# EAGLE design 180V PSU (EAGLE 6.1)
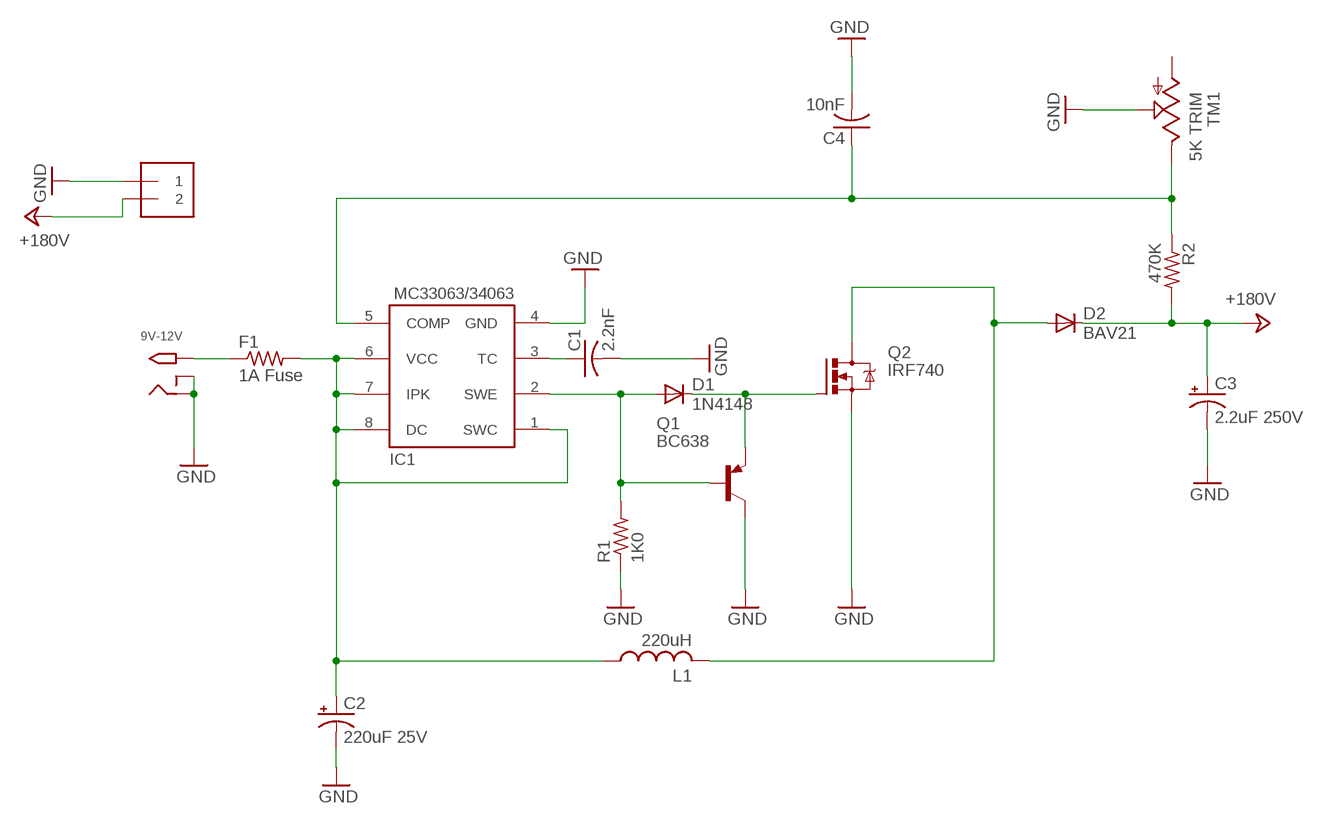
[diagram p0: schematic, sheet 1]

## Parts
9V-12V  2.1MMJACKTHM  [PJ-102A]
C1  2.2nF  C-US025-030X050  [C025-030X050]
C2  220uF 25V  CPOL-USE2.5-6  [E2,5-6]
C3  2.2uF 250V  CPOL-USE2.5-6  [E2,5-6]
C4  10nF  C-US025-030X050  [C025-030X050]
D1  1N4148  1N4148DO35-10  [DO35-10]
D2  BAV21  [DO35-10]
F1  1A Fuse  R-US_0204/5  [0204/5]
IC1  MC33063/MC34063P  [DIL08]
J1  1X2-3.5MM  [1X2-3.5MM]
L1  220uH  L-US6000-XXX-RC  [6000-XXXX-RC]
Q1  BC638  [TO92-BCE]
Q2  IRF740  [TO220BV]
R1  1K0  R-US_0207/10  [0207/10]
R2  470K  R-US_0207/10  [0207/10]
TM1  5K TRIM  TRIM  [6MM]

## Nets
+24V: C3.+ D2.C J1.2 R2.2 ; supply symbol labelled +180V
GND: 9V-12V.RING 9V-12V.RING_SW C1.2 C2.- C3.- C4.2 IC1.4(GND) J1.1 Q1.C Q2.S R1.1 TM1.S
N$1: 9V-12V.TIP F1.1
N$2: D2.A L1.2 Q2.D
N$3: D1.A IC1.2(SWE) Q1.B R1.2
N$4: D1.C Q1.E Q2.G
N$5: C4.1 IC1.5(COMP) R2.1 TM1.E
N$6: C1.1 IC1.3(TC)
N$8: C2.+ F1.2 IC1.1(SWC) IC1.6(VCC) IC1.7(IPK) IC1.8(DC) L1.1
Unconnected: TM1.A

## Library data of the parts
9V-12V = adafruit:2.1MMJACK: 2.1mm x 5.5mm THM DC jack with internal switch. Digikey part #PJ-102A, 4UCON part #05537 2.1mm x 5.5mm SMT DC jack with internal switch. Digikey part #PJ-002A-SMT, 4UCON part #03267 By microbuilder.eu & adafruit.com
C1 C4 = resistor:C-US: CAPACITOR, American symbol
C2 C3 = rcl:CPOL-US: POLARIZED CAPACITOR, American symbol
D1 = diode:1N4148: DIODE high speed (Philips)
D2 = diode:BAV21: DIODE high-voltage general purpose diode
F1 = rcl:R-US_: RESISTOR, American symbol
IC1 = adafruit:MC33063/MC34063: MC33063 and MC34063 Basic DC/DC converter with internal power-NPN transistor, 100KHz, 1.5A peak switch current. 3-40 input/output.
J1 = adafruit:1X2: 3.5mm Terminal block http://www.ladyada.net/library/pcb/eaglelibrary.html
L1 = rcl:L-US: INDUCTOR, American symbol
Q1 = transistor-pnp:BC638*: PNP Transistror
Q2 = transistor-power:IRF740: N-CHANNEL MOS FET
R1 R2 = resistor:R-US_: RESISTOR, American symbol
TM1 = adafruit:TRIM

## Board
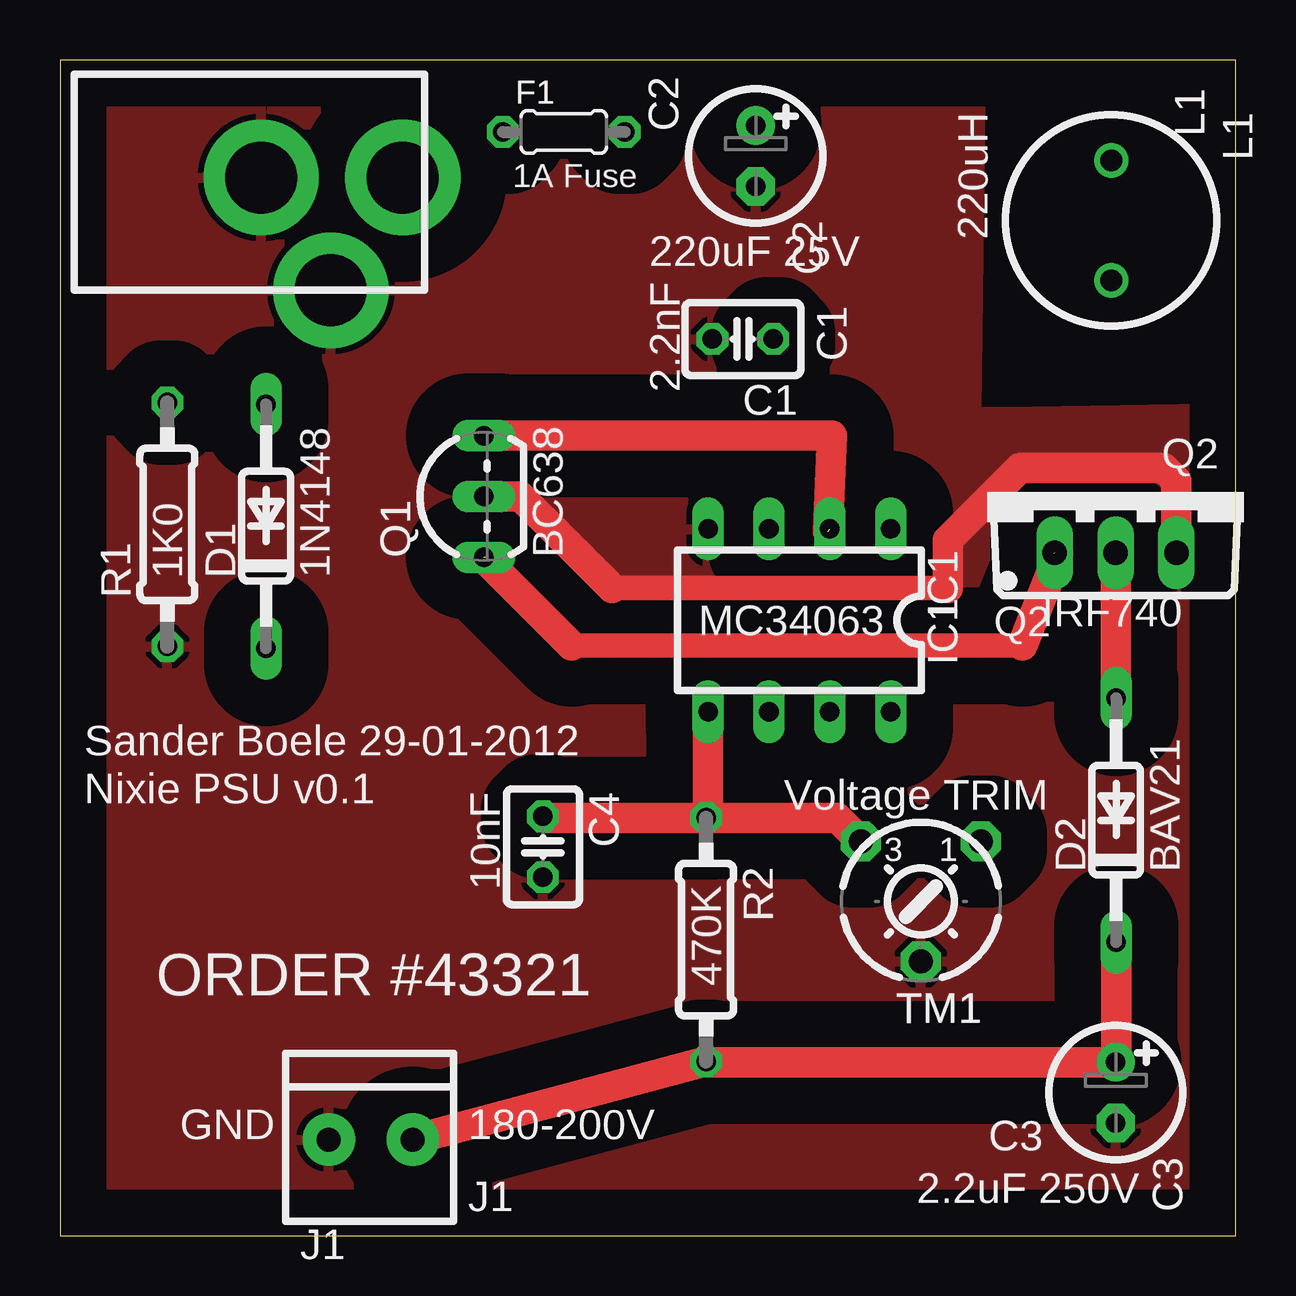
[diagram p1: board, top side]
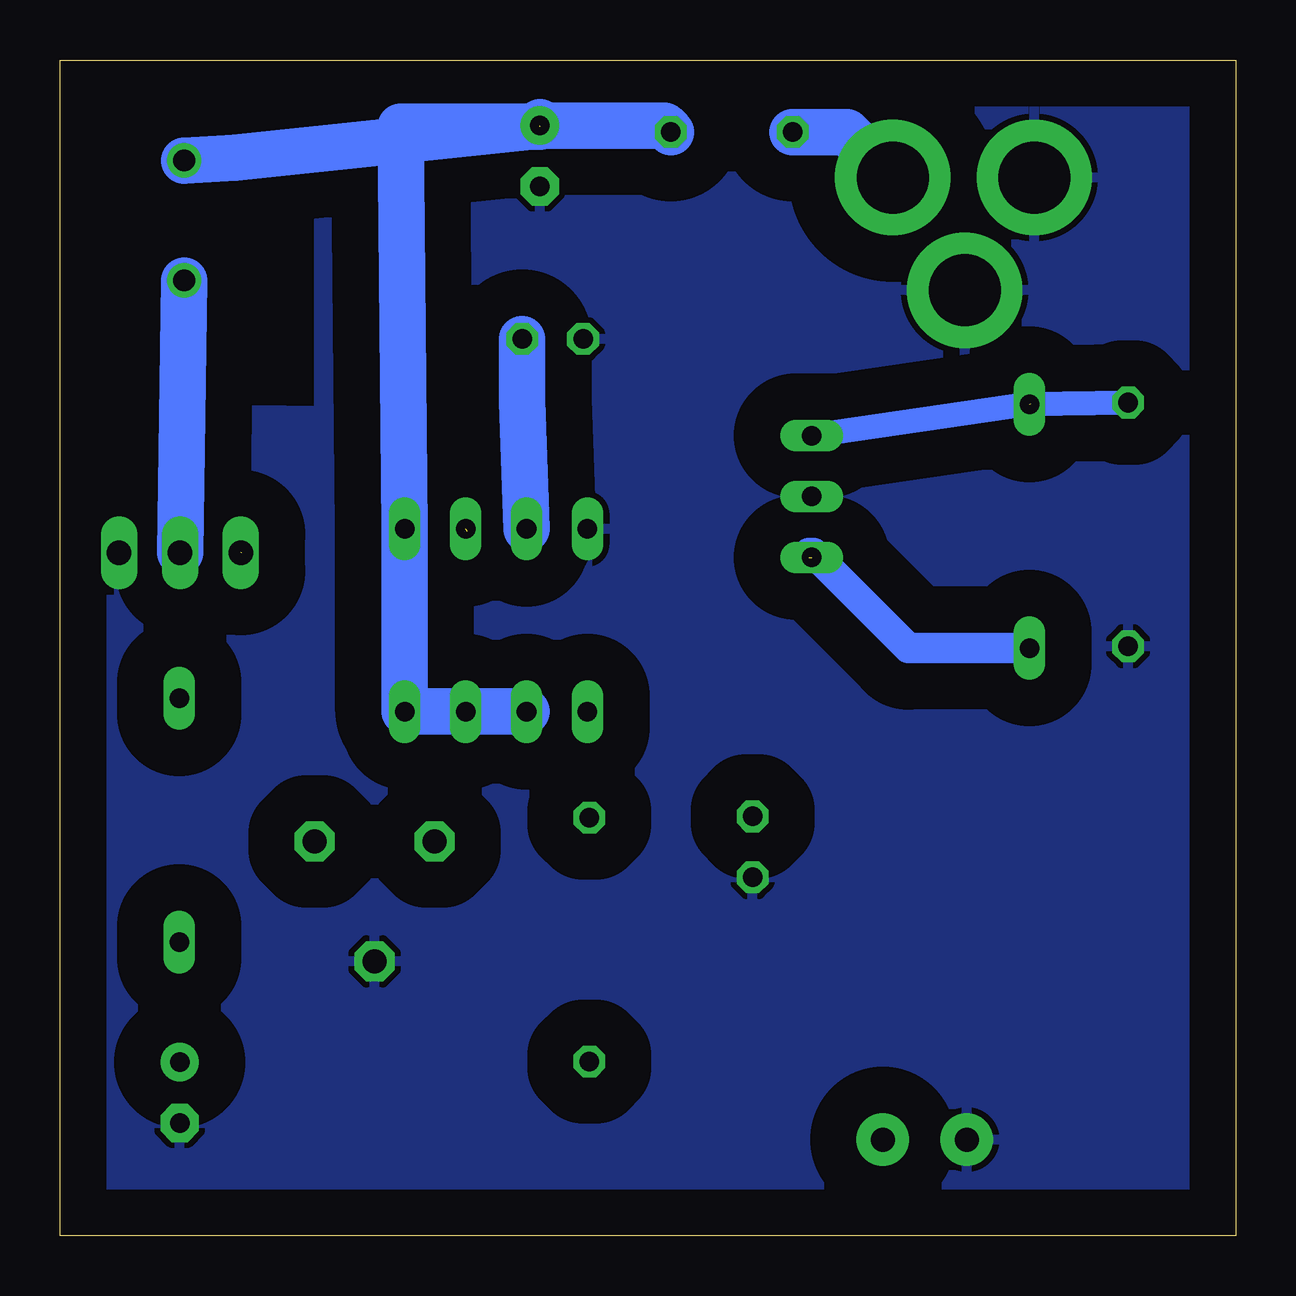
[diagram p2: board, bottom side, seen from below]

Size 49 x 49 mm. Coordinates in mm from the lower left corner, seen from the top.
Outline: 0,0 49,0 49,49 0,49 0,0
Copper layers (1*16): Top 0.035mm / dielectric 1.5mm / Bottom 0.035mm
Design rules: minimum track width 6mil, minimum drill 12mil, track to track 6mil, track to pad 6mil, pad to pad 6mil, via to via 6mil, smd to smd 0mil, copper to edge 10mil, drill to drill 10mil, minimum pad ring 10mil, minimum via ring 6mil, stop-mask expansion 2mil, vias tented up to drill 100mil, thermal gap 10mil

### Footprints (pad centres in the part's own frame; a part is rotated, then mirrored left to right if it is on the bottom)
PJ-102A = drill 3 pad 4.8: RING 0.1,-3.39; RING_SW -4.6,-6.29; TIP 0.1,-9.29
C025-030X050 = drill 0.813 octagon: 1 -1.27,0; 2 1.27,0
E2,5-6 = drill 0.813 pad 1.6: + -1.27,0 | drill 0.813 pad 1.6 octagon: - 1.27,0
DO35-10 = drill 0.813 long: A 5.08,0; C -5.08,0
0204/5 = drill 0.813 octagon: 1 -2.54,0; 2 2.54,0
DIL08 = drill 0.813 long: 1 -3.81,-3.81; 2 -1.27,-3.81; 3 1.27,-3.81; 4 3.81,-3.81; 5 3.81,3.81; 6 1.27,3.81; 7 -1.27,3.81; 8 -3.81,3.81
1X2-3.5MM = drill 1 pad 2.184: 1 1.8,0; 2 -1.7,0
6000-XXXX-RC = drill 0.9 pad 1.422: 1 -2.5,0; 2 2.5,0
TO92-BCE = drill 0.813 long: B 2.54,0; C 0,0; E -2.54,0
TO220BV = drill 1.016 long: D 0,-2.54; G -2.54,-2.54; S 2.54,-2.54
0207/10 = drill 0.813 octagon: 1 -5.08,0; 2 5.08,0
6MM = drill 1 pad 1.676 octagon: A -2.5,-2.5; E 2.5,-2.5; S 0,2.5

### Placement (x,y rotation side)
9V-12V  5,44 90 top
C1  28.46,37.37 180 top
C2  29,45 270 top
C3  44.01,5.96 270 top
C4  20.13,16.2 270 top
D1  8.59,29.57 90 top
D2  44.02,17.31 90 top
F1  21,46 0 top
IC1  30.82,25.64 180 top
J1  13,4 180 top
L1  43.82,42.31 270 top
Q1  17.67,30.8 90 top
Q2  44,31 0 top
R1  4.48,29.64 90 top
R2  26.93,12.33 270 top
TM1  35.89,13.93 180 top

### Tracks (layer width: path | path; a pad name or v marks a point on that pad's centre or on a via)
+24V
  Top 1.27: D2.C 44.02,7.24 C3.+ 26.96,7.23 R2.2 J1.2
GND
  Top 1.016: 23,27 37,27
  Top 1.27: Q1.C 19.2,30.8 23,27 | 37,27 37,29 40,32 46,32 46.54,31.46 Q2.S
  pour Top (isolate 1.93): 0,49.07 0,0.18 49.07,0.18 49.07,34.49 39.29,34.32 38.23,34.32 38.4,49.07
  pour Bottom (isolate 1.93): 0,49.07 38.23,49.07 38.23,34.36 49.07,34.54 49.07,0 0,0
N$1
  Bottom 1.93: 9V-12V.TIP 16.19,46 F1.1
N$2
  Top 1.27: D2.A 44,22.42 Q2.D
  Bottom 1.93: L1.2 Q2.D
N$3  (2 unrouted)
  Top 1.27: Q1.B 32.18,33.34 32,29.34
  Bottom 1.016: Q1.B 8.53,34.67 | R1.2 D1.A
N$4  (2 unrouted)
  Top 1.016: 21.33,24.6 40.12,24.6
  Top 1.27: Q1.E 21.33,24.6 | 40.12,24.6 41.43,27.91 41.43,28.45 41.6,28.45
  Bottom 1.27: D1.C 13.64,24.49 17.6,28.45 17.78,28.45 17.78,28.27 | 41.46,27.59 Q2.G
N$5
  Top 1.27: R2.1 27.01,17.49 IC1.5 | C4.1 20.19,17.41 R2.1 | TM1.E 32.4,17.41 R2.1
N$6
  Bottom 1.93: C1.1 29.73,34.79 IC1.3
N$8  (1 unrouted)
  Bottom 1.93: L1.1 41.69,44.93 C2.+ 23.81,46.27 F1.2 | 28.98,46.41 28.98,46.23 34.81,46.23 IC1.1 IC1.8 IC1.7 IC1.6

### Text on the board
_tsilk: C2 | L1 | F1 | 220uH | 1A Fuse | 220uF 25V | 2.2nF | C1 | Q2 | Q1 | BC638 | R1 | 1K0 | D1 | 1N4148 | IC1 | MC34063 | IRF740 | Sander Boele 29-01-2012 | Voltage TRIM | Nixie PSU v0.1 | 10nF | C4 | 3 | 1 | 470K | R2 | D2 | BAV21 | ORDER #43321 | TM1 | GND | 180-200V | C3 | J1 | 2.2uF 250V